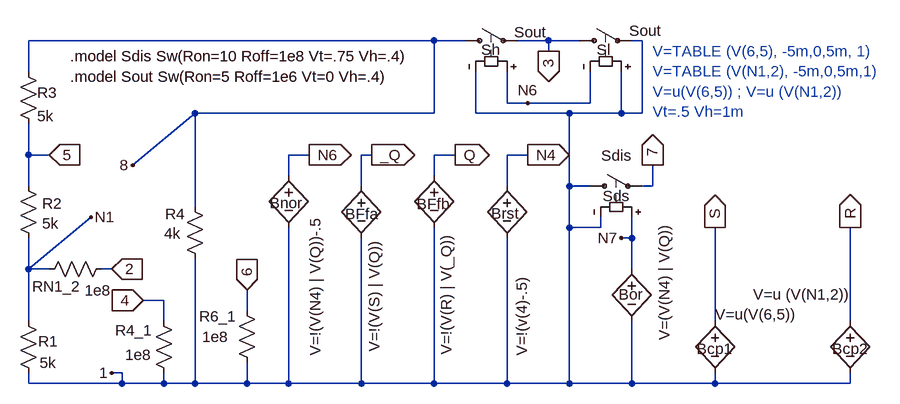
[diagram p0: schematic Lt555BehDig.asc]
Lt555BehDig.asc, the LTspice schematic file:
Version 4
SHEET 1 1152 916
WIRE -576 144 -576 96
WIRE -576 272 -576 224
WIRE -576 320 -576 272
WIRE -576 448 -576 400
WIRE -576 528 -576 448
WIRE -576 624 -576 608
WIRE -544 272 -576 272
WIRE -544 448 -576 448
WIRE -480 368 -576 448
WIRE -448 448 -464 448
WIRE -432 608 -448 608
WIRE -432 624 -576 624
WIRE -432 624 -432 608
WIRE -368 496 -400 496
WIRE -368 528 -368 496
WIRE -368 624 -432 624
WIRE -368 624 -368 608
WIRE -320 208 -416 288
WIRE -320 352 -320 208
WIRE -320 624 -368 624
WIRE -320 624 -320 432
WIRE -240 512 -240 480
WIRE -240 624 -320 624
WIRE -240 624 -240 592
WIRE -176 304 -176 272
WIRE -176 624 -240 624
WIRE -176 624 -176 384
WIRE -144 272 -176 272
WIRE -64 320 -64 272
WIRE -64 624 -176 624
WIRE -64 624 -64 400
WIRE -48 272 -64 272
WIRE 48 96 -576 96
WIRE 48 208 -320 208
WIRE 48 208 48 96
WIRE 48 304 48 272
WIRE 48 624 -64 624
WIRE 48 624 48 384
WIRE 80 272 48 272
WIRE 96 96 48 96
WIRE 112 208 112 144
WIRE 160 192 160 144
WIRE 160 320 160 272
WIRE 160 624 48 624
WIRE 160 624 160 400
WIRE 192 192 160 192
WIRE 192 272 160 272
WIRE 224 96 176 96
WIRE 224 112 224 96
WIRE 256 208 112 208
WIRE 256 320 256 208
WIRE 256 384 256 320
WIRE 256 624 160 624
WIRE 256 624 256 384
WIRE 272 96 224 96
WIRE 288 192 192 192
WIRE 288 192 288 144
WIRE 288 320 256 320
WIRE 304 384 256 384
WIRE 304 384 304 368
WIRE 336 208 256 208
WIRE 336 208 336 144
WIRE 352 400 336 400
WIRE 352 400 352 368
WIRE 352 448 352 400
WIRE 352 624 256 624
WIRE 352 624 352 528
WIRE 368 96 352 96
WIRE 368 208 336 208
WIRE 368 208 368 96
WIRE 384 320 368 320
WIRE 384 320 384 288
WIRE 480 528 480 384
WIRE 480 624 352 624
WIRE 480 624 480 608
WIRE 688 528 688 384
WIRE 688 624 480 624
WIRE 688 624 688 608
FLAG -480 368 N1
FLAG -544 272 5
IOPIN -544 272 In
FLAG 384 288 7
IOPIN 384 288 Out
FLAG 336 400 N7
FLAG -416 288 8
FLAG 224 112 3
IOPIN 224 112 Out
FLAG 192 192 N6
FLAG -448 608 1
FLAG -400 496 4
IOPIN -400 496 In
FLAG -240 480 6
IOPIN -240 480 In
FLAG 480 384 S
IOPIN 480 384 Out
FLAG -448 448 2
IOPIN -448 448 In
FLAG 688 384 R
IOPIN 688 384 Out
FLAG -144 272 N6
IOPIN -144 272 Out
FLAG -48 272 _Q
IOPIN -48 272 Out
FLAG 80 272 Q
IOPIN 80 272 Out
FLAG 192 272 N4
IOPIN 192 272 Out
SYMBOL res -592 512 R0
WINDOW 0 31 47 Left 0
WINDOW 3 33 80 Left 0
SYMATTR InstName R1
SYMATTR Value 5k
SYMBOL res -592 304 R0
WINDOW 0 37 43 Left 0
WINDOW 3 37 74 Left 0
SYMATTR InstName R2
SYMATTR Value 5k
SYMBOL res -592 128 R0
WINDOW 0 29 48 Left 0
WINDOW 3 29 84 Left 0
SYMATTR InstName R3
SYMATTR Value 5k
SYMBOL sw 272 320 R270
WINDOW 0 -15 35 VRight 0
WINDOW 3 47 33 VRight 0
SYMATTR InstName Sds
SYMATTR Value Sdis
SYMBOL sw 80 96 R270
WINDOW 0 -14 40 VRight 0
WINDOW 3 13 91 VRight 0
SYMATTR InstName Sh
SYMATTR Value Sout
SYMBOL sw 256 96 R270
WINDOW 0 -14 42 VRight 0
WINDOW 3 15 92 VRight 0
SYMATTR InstName Sl
SYMATTR Value Sout
SYMBOL res -336 336 R0
WINDOW 0 -30 27 Left 0
WINDOW 3 -31 57 Left 0
SYMATTR InstName R4
SYMATTR Value 4k
SYMBOL res -560 464 R270
WINDOW 0 -26 27 VTop 0
WINDOW 3 -1 91 VBottom 0
SYMATTR InstName RN1_2
SYMATTR Value 1e8
SYMBOL bv 480 512 R0
WINDOW 0 -28 59 Left 0
WINDOW 3 126 6 Right 0
SYMATTR InstName Bcp1
SYMATTR Value V=u(V(6,5))
SYMBOL bv 688 512 R0
WINDOW 0 -28 59 Left 0
WINDOW 3 -149 -25 Left 0
SYMATTR InstName Bcp2
SYMATTR Value V=u (V(N1,2))
SYMBOL bv 352 432 R0
WINDOW 0 -20 55 Left 0
WINDOW 3 50 -54 VRight 0
SYMATTR InstName Bor
SYMATTR Value V=(V(N4) | V(Q))
SYMBOL bv -176 288 R0
WINDOW 0 -29 58 Left 0
WINDOW 3 41 79 VRight 0
SYMATTR InstName Bnor
SYMATTR Value V=!(V(N4) | V(Q))-.5
SYMBOL bv -64 304 R0
WINDOW 0 -25 59 Left 0
WINDOW 3 20 100 VRight 0
SYMATTR InstName BFfa
SYMATTR Value V=!(V(S) | V(Q))
SYMBOL bv 48 288 R0
WINDOW 0 -27 60 Left 0
WINDOW 3 19 106 VRight 0
SYMATTR InstName BFfb
SYMATTR Value V=!(V(R) | V(_Q))
SYMBOL bv 160 304 R0
WINDOW 0 -24 58 Left 0
WINDOW 3 23 278 VLeft 0
SYMATTR InstName Brst
SYMATTR Value V=!(v(4)-.5)
SYMBOL res -256 496 R0
WINDOW 0 0 25 Right 0
WINDOW 3 -53 56 Left 0
SYMATTR InstName R6_1
SYMATTR Value 1e8
SYMBOL res -384 512 R0
WINDOW 0 -59 30 Left 0
WINDOW 3 -43 68 Left 0
SYMATTR InstName R4_1
SYMATTR Value 1e8
TEXT -512 120 Left 0 !.model Sdis Sw(Ron=10 Roff=1e8 Vt=.75 Vh=.4)\n.model Sout Sw(Ron=5 Roff=1e6 Vt=0 Vh=.4)
TEXT 384 112 Left 0 ;V=TABLE (V(6,5), -5m,0,5m, 1)\nV=TABLE (V(N1,2), -5m,0,5m,1)\nV=u(V(6,5)) ; V=u (V(N1,2))\nVt=.5 Vh=1m

The netlist it stands for:
* Lt555BehDig.asc
R1 N1 1 5k
R2 5 N1 5k
R3 8 5 5k
Sds 1 7 N7 1 Sdis
Sh 8 3 N6 1 Sout
Sl 3 1 1 N6 Sout
R4 8 1 4k
RN1_2 N1 2 1e8
Bcp1 S 1 V=u(V(6,5))
Bcp2 R 1 V=u (V(N1,2))
Bor N7 1 V=(V(N4) | V(Q))
Bnor N6 1 V=!(V(N4) | V(Q))-.5
BFfa _Q 1 V=!(V(S) | V(Q))
BFfb Q 1 V=!(V(R) | V(_Q))
Brst N4 1 V=!(v(4)-.5)
R6_1 6 1 1e8
R4_1 4 1 1e8
.model Sdis Sw(Ron=10 Roff=1e8 Vt=.75 Vh=.4)
.model Sout Sw(Ron=5 Roff=1e6 Vt=0 Vh=.4)
* V=TABLE (V(6,5), -5m,0,5m, 1)
* V=TABLE (V(N1,2), -5m,0,5m,1)
* V=u(V(6,5)) ; V=u (V(N1,2))
* Vt=.5 Vh=1m
.backanno
.end